# Altium schematic sheet [03] - SCHEMATIC.SchDoc
size Letter; CheckedBy: Pablo M.; DocumentNumber: 3; Revision: v1; SheetNumber: 3; SheetTotal: 3
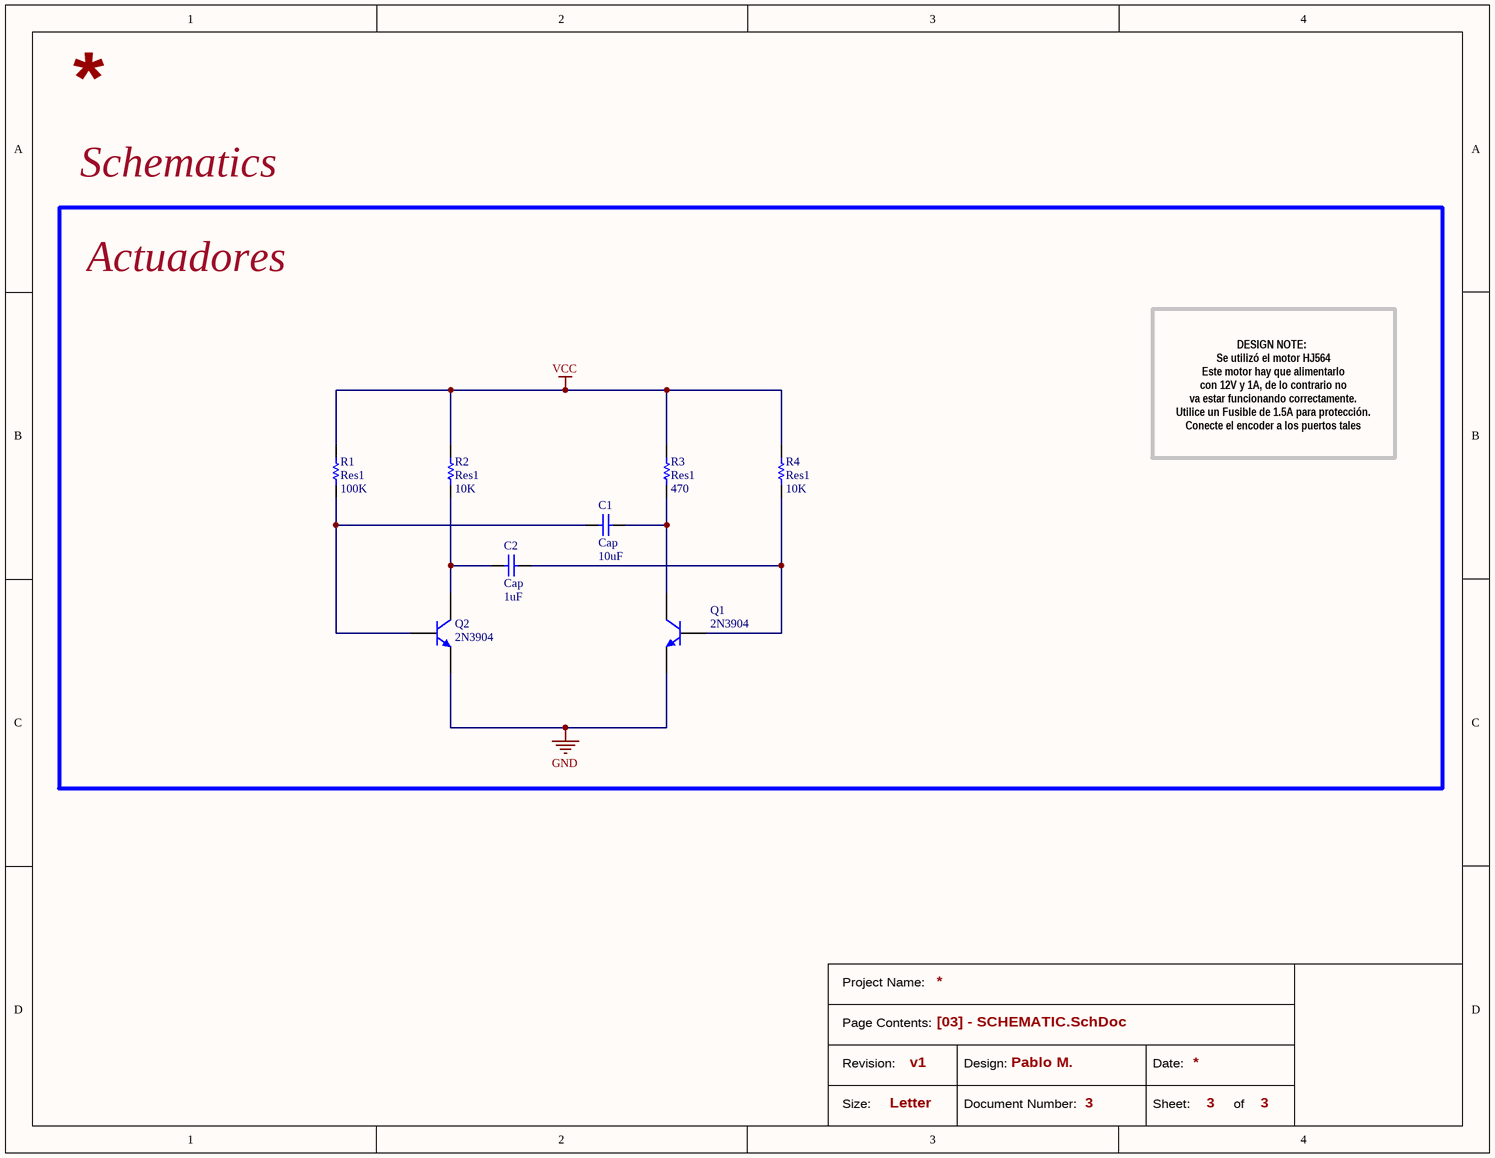
[diagram p0: [03] - SCHEMATIC.SchDoc]

## Parts
C1  Cap  value 10uF  [RAD-0.3]
C2  Cap  value 1uF  [RAD-0.3]
Q1  2N3904  [TO-92A]
Q2  2N3904  [TO-92A]
R1  Res1  value 100K  [AXIAL-0.3]
R2  Res1  value 10K  [AXIAL-0.3]
R3  Res1  value 470  [AXIAL-0.3]
R4  Res1  value 10K  [AXIAL-0.3]

## Blocks framed on the sheet
Actuadores: C1 C2 Q1 Q2 R1-R4

## Nets
GND: Q1.1(E) Q2.1(E)
VCC: R1.2 R2.2 R3.2 R4.2
NetC1_1: C1.1 Q2.2(B) R1.1
NetC1_2: C1.2 Q1.3(C) R3.1
NetC2_1: C2.1 Q2.3(C) R2.1
NetC2_2: C2.2 Q1.2(B) R4.1

## Notes on the sheet
- Schematics
- DESIGN NOTE:
  Se utilizó el motor HJ564
  Este motor hay que alimentarlo
  con 12V y 1A, de lo contrario no
  va estar funcionando correctamente.
  Utilice un Fusible de 1.5A para protección.
  Conecte el encoder a los puertos tales
- Project Name:
- Page Contents:
- Size:
- Revision:
- Letter
- Design:
- Document Number:
- Date:
- Sheet:
- of

## Library data of the parts
C1 C2 = Cap: Capacitor; Published: 8-Jun-2000; LatestRevisionDate: 17-Jul-2002; LatestRevisionNote: Re-released for DXP Platform.; PackageReference: RAD-0.3; Publisher: Altium Limited; PackageDescription: Radial Cap, Thru-Hole; 2 Leads; 0.3 in Pin Spacing
Q1 Q2 = 2N3904: NPN General Purpose Amplifier; Published: 8-Jun-2000; LatestRevisionDate: 15-Jan-2003; LatestRevisionNote: PCB Footprint 'BCY-W3/D4.7' replaced; DatasheetVersion: 1997; PackageVersion: Sep-1998; PackageReference: TO-92A; Publisher: Altium Limited; PackageDescription: TO, Flat Index; 3 In-Line, Axial Leads; Body Dia. 4.5mm; Leads 0.51 x 0.48 mm (max); ComponentLink1Description: Manufacturer Link; ComponentLink1URL: http://www.fairchildsemi.com/; ComponentLink2Description: Datasheet; ComponentLink2URL: http://www.fairchildsemi.com/ds/2N%2F2N3904.pdf
R1-R4 = Res1: Resistor; Published: 8-Jun-2000; LatestRevisionDate: 17-Jul-2002; LatestRevisionNote: Re-released for DXP Platform.; PackageReference: AXIAL-0.3; Publisher: Altium Limited; PackageDescription: Axial Device, Thru-Hole; 2 Leads; 0.3 in Pin Spacing